# EAGLE design Regulador5V (EAGLE 9.6.2)
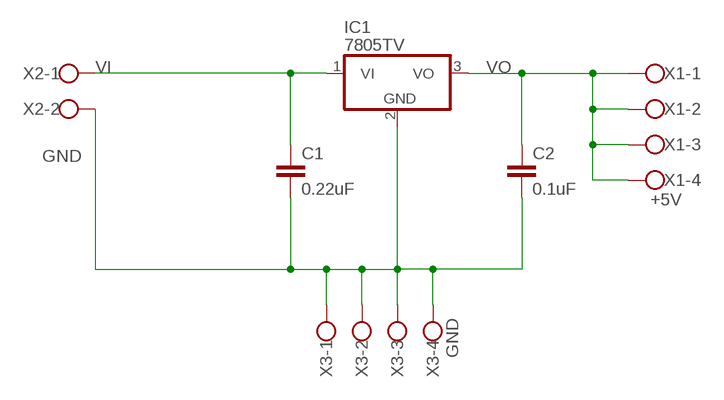
[diagram p0: schematic, sheet 1]

## Parts
C1  0.22uF  C2.5/2  [C2.5-2]
C2  0.1uF  C2.5/2  [C2.5-2]
IC1  7805TV  [TO220V]
X1  +5V  W237-4  [W237-4]
X2  W237-102  [W237-102]
X3  GND  W237-4  [W237-4]

## Nets
GND: C1.2 C2.2 IC1.2(GND) X2.2 X3.1 X3.2 X3.3 X3.4
VI: C1.1 IC1.1(VI) X2.1
VO: C2.1 IC1.3(VO) X1.1 X1.2 X1.3 X1.4

## Library data of the parts
C1 C2 = capacitor-wima:C: CAPACITOR naming: grid - package width
IC1 = linear:78*: Positive VOLTAGE REGULATOR Source: http://cache.national.com/ds/LM/LM78L05.pdf http://www.fairchildsemi.com/ds/LM/LM7805.pdf
X1 X3 = con-wago-500:W237-4: WAGO SCREW CLAMP; OC_FARNELL: unknown; OC_NEWARK: unknown
X2 = con-wago-500:W237-102: WAGO SCREW CLAMP; MPN: 237-102; OC_FARNELL: unknown; OC_NEWARK: 70K9898

## Board
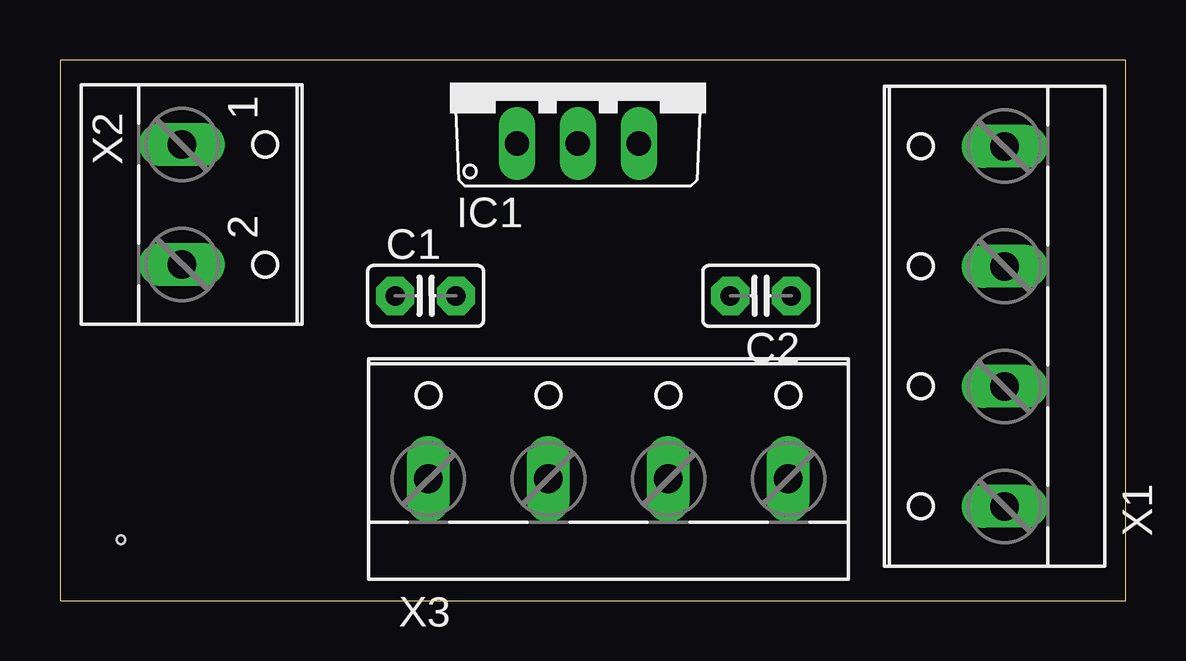
[diagram p1: board, top side]
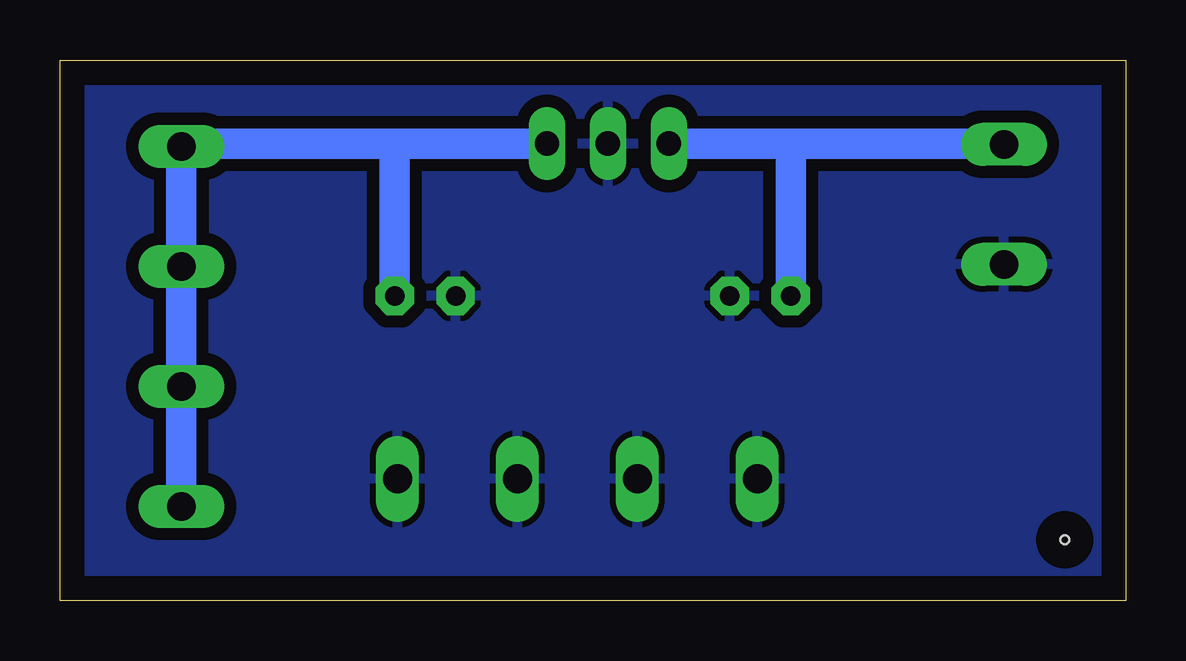
[diagram p2: board, bottom side, seen from below]

Size 44.43 x 22.53 mm. Coordinates in mm from the lower left corner, seen from the top.
Outline: 0,0 44.43,0 44.43,22.53 0,22.53 0,0
Copper layers (1*16): Top 0.035mm / dielectric 1.5mm / Bottom 0.035mm
Design rules "default": minimum track width 6mil, minimum drill 0.35mm, track to track 6mil, track to pad 6mil, pad to pad 6mil, via to via 6mil, smd to smd 6mil, copper to edge 40mil, drill to drill 6mil, minimum pad ring 10mil, minimum via ring 8mil, stop-mask expansion 4mil, vias tented up to drill 0mil, thermal gap 10mil
Holes 0.35 mm at 2.54,2.54

### Footprints (pad centres in the part's own frame; a part is rotated, then mirrored left to right if it is on the bottom)
C2.5-2 = drill 0.813 pad 1.6 octagon: 1 -1.27,0; 2 1.27,0
TO220V = drill 1.016 long: 1 -2.54,-2.54; 2 0,-2.54; 3 2.54,-2.54
W237-4 = drill 1.194 long: 1 -7.5,-1.27; 2 -2.5,-1.27; 3 2.5,-1.27; 4 7.5,-1.27
W237-102 = drill 1.194 long: 1 -2.5,-1.27; 2 2.5,-1.27

### Placement (x,y rotation side)
C1  15.24,12.7 0 top
C2  29.21,12.7 180 top
IC1  21.59,21.59 0 top
X1  38.1,11.43 90 top
X2  6.35,16.51 270 top
X3  22.86,6.35 0 top

### Tracks (layer width: path | path; a pad name or v marks a point on that pad's centre or on a via)
GND
  pour Bottom (isolate 0.508): 0,0 44.45,0 44.45,22.86 0,22.86
VI
  Bottom 1.27: X2.1 5.12,19.05 13.97,19.05 | 13.97,19.05 IC1.1 | C1.1 13.97,19.05
VO
  Bottom 1.27: X1.1 X1.2 X1.3 X1.4 39.25,19.05 30.48,19.05 | IC1.3 30.48,19.05 | C2.1 30.48,19.05